# EAGLE design shield (EAGLE 5.10)
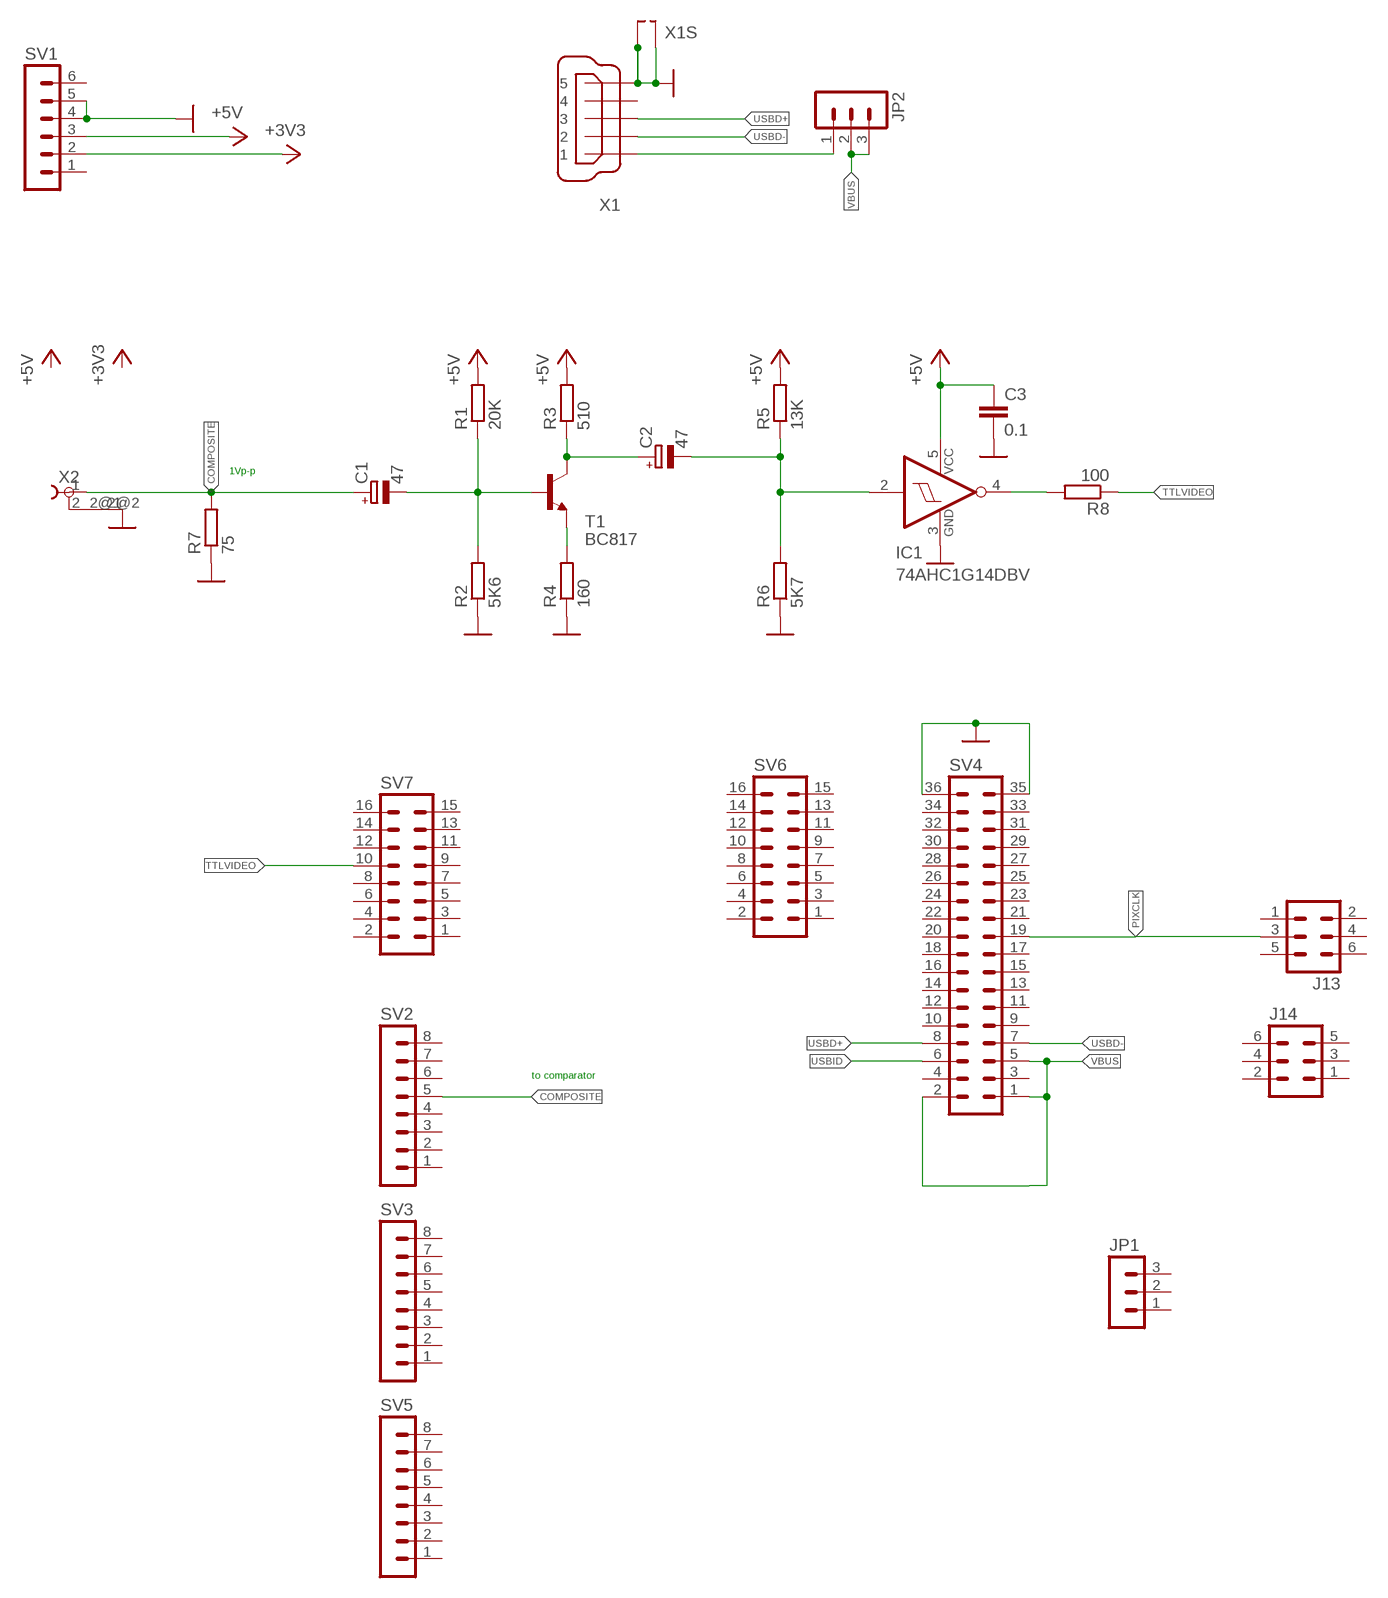
[diagram p0: schematic, sheet 1]

## Parts
C1  47  CPOL-EUSMCC  [SMC_C]
C2  47  CPOL-EUSMCC  [SMC_C]
C3  0.1  C-EUC0603  [C0603]
IC1  74AHC1G14DBV  [SOT23-5]
J13  MA03-2  [MA03-2]
J14  MA03-2  [MA03-2]
JP1  MA03-1  [MA03-1]
JP2  MA03-1  [MA03-1]
R1  20K  R-EU_R0805  [R0805]
R2  5K6  R-EU_R0805  [R0805]
R3  510  R-EU_R0805  [R0805]
R4  160  R-EU_R0805  [R0805]
R5  13K  R-EU_R0805  [R0805]
R6  5K7  R-EU_R0805  [R0805]
R7  75  R-EU_R0805  [R0805]
R8  100  R-EU_R0805  [R0805]
SV1  MA06-1  [MA06-1]
SV2  MA08-1  [MA08-1]
SV3  MA08-1  [MA08-1]
SV4  MA18-2  [MA18-2]
SV5  MA08-1  [MA08-1]
SV6  MA08-2  [MA08-2]
SV7  MA08-2  [MA08-2]
T1  BC817  BC817-16-NPN-SOT23-BEC  [SOT23-BEC]
X1  MINI-USB_SHIELD5P2-32005-601  [32005-601]
X2  TOBU3  [TOBU3]

## Nets
+3V3: SV1.2
+5V: C3.1 IC1.5(VCC) R1.2 R3.2 R5.2 SV1.3
COMPOSITE: C1.+ R7.2 SV2.5 X2.1
GND: C3.2 IC1.3(GND) R2.1 R4.1 R6.1 R7.1 SV1.4 SV1.5 SV4.35 SV4.36 X1.5 X1.M1(S1) X1.M2(S2) X2.2@2
N$1: IC1.4(O) R8.2
N$2: C1.- R1.1 R2.2 T1.B
N$3: R4.2 T1.E
N$4: C2.+ R3.1 T1.C
N$5: C2.- IC1.2(I) R5.1 R6.2
N$6: JP2.1 X1.1
PIXCLK: J13.3 SV4.19
TTLVIDEO: R8.1 SV7.10
USBD+: SV4.8 X1.3
USBD-: SV4.7 X1.2
USBID: SV4.6
VBUS: JP2.2 JP2.3 SV4.1 SV4.2 SV4.5
Unconnected: J13.1 J13.2 J13.4 J13.5 J13.6 J14.1 J14.2 J14.3 J14.4 J14.5 J14.6 JP1.1 JP1.2 JP1.3 SV1.1 SV1.6 SV2.1 SV2.2 SV2.3 SV2.4 SV2.6 SV2.7 SV2.8 SV3.1 SV3.2 SV3.3 SV3.4 SV3.5 SV3.6 SV3.7 SV3.8 SV4.3 SV4.4 SV4.9 SV4.10 SV4.11 SV4.12 SV4.13 SV4.14 SV4.15 SV4.16 SV4.17 SV4.18 SV4.20 SV4.21 SV4.22 SV4.23 SV4.24 SV4.25 SV4.26 SV4.27 SV4.28 SV4.29 SV4.30 SV4.31 SV4.32 SV4.33 SV4.34 SV5.1 SV5.2 SV5.3 SV5.4 SV5.5 SV5.6 SV5.7 SV5.8 SV6.1 SV6.2 SV6.3 SV6.4 SV6.5 SV6.6 SV6.7 SV6.8 SV6.9 SV6.10 SV6.11 SV6.12 SV6.13 SV6.14 SV6.15 SV6.16 SV7.1 SV7.2 SV7.3 SV7.4 SV7.5 SV7.6 SV7.7 SV7.8 SV7.9 SV7.11 SV7.12 SV7.13 SV7.14 SV7.15 SV7.16 X1.4 X2.2 X2.2@1

## Notes on the sheet
- 1Vp-p
- to comparator

## Library data of the parts
C1 C2 = rcl:CPOL-EU: POLARIZED CAPACITOR, European symbol
C3 = rcl:C-EU: CAPACITOR, European symbol
IC1 = 74xx-little-us:74*1G14: Single Schmitt-Trigger Inverter Gate
J13 J14 = con-lstb:MA03-2: PIN HEADER
JP1 JP2 = con-lstb:MA03-1: PIN HEADER
R1-R8 = rcl:R-EU_: RESISTOR, European symbol
SV1 = con-lstb:MA06-1: PIN HEADER
SV2 SV3 SV5 = con-lstb:MA08-1: PIN HEADER
SV4 = con-lstb:MA18-2: PIN HEADER
SV6 SV7 = con-lstb:MA08-2: PIN HEADER
T1 = transistor:*-NPN-: NPN Transistror BF959 corrected 2008.03.06
X1 = usb-mini:MINI-USB_SHIELD5P2-: MINI USB-B R/A DIP 5pol. Source: www.cypressindustries.com
X2 = con-hirschmann:TOBU3: Female Cinch CONNECTOR ( RCA Jack )

## Board
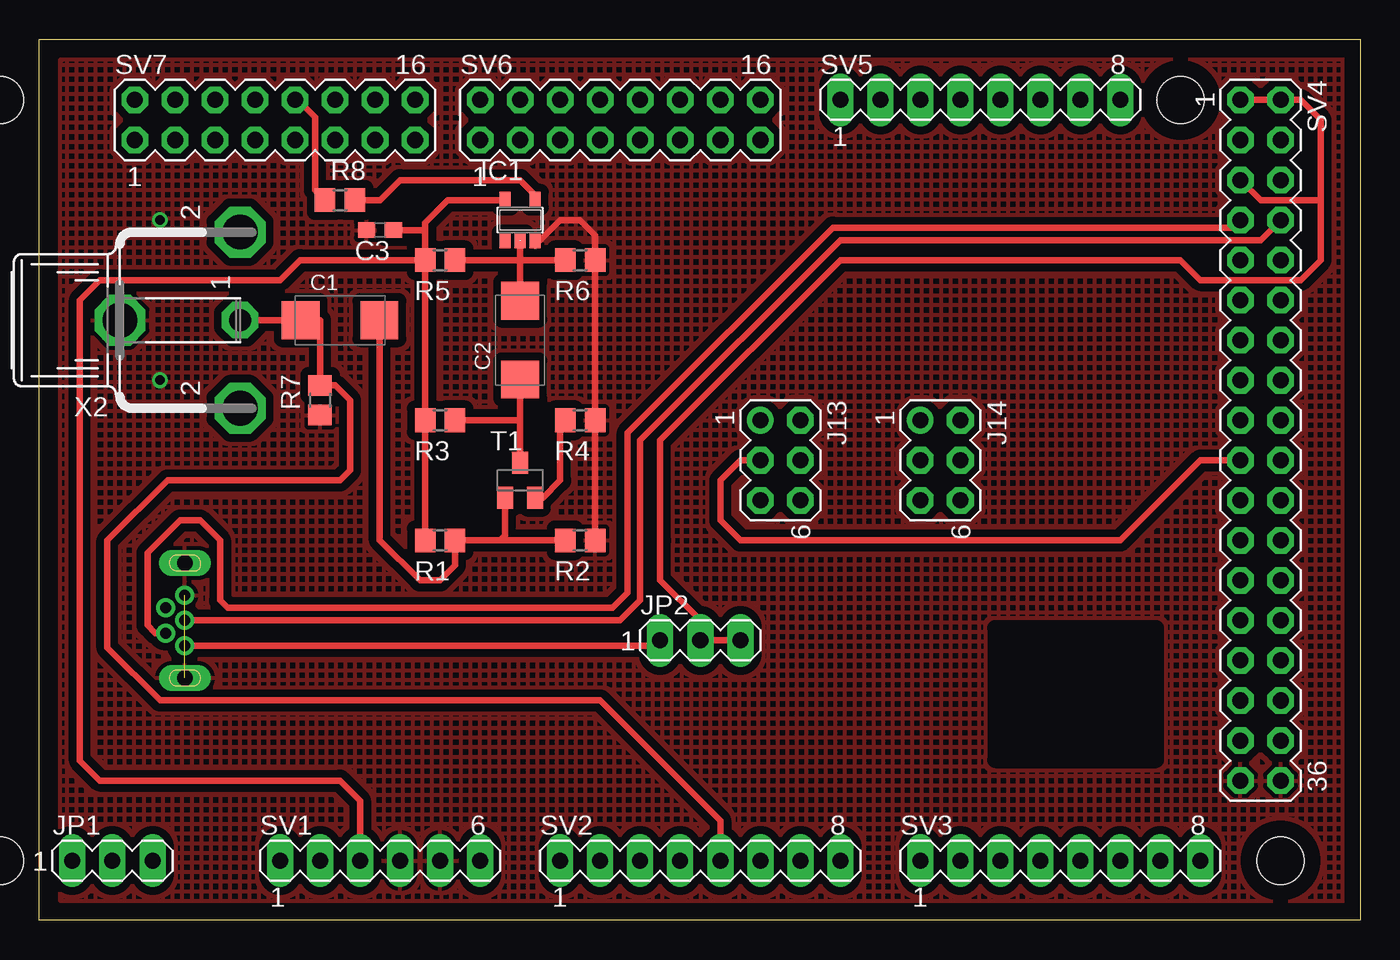
[diagram p1: board, top side]
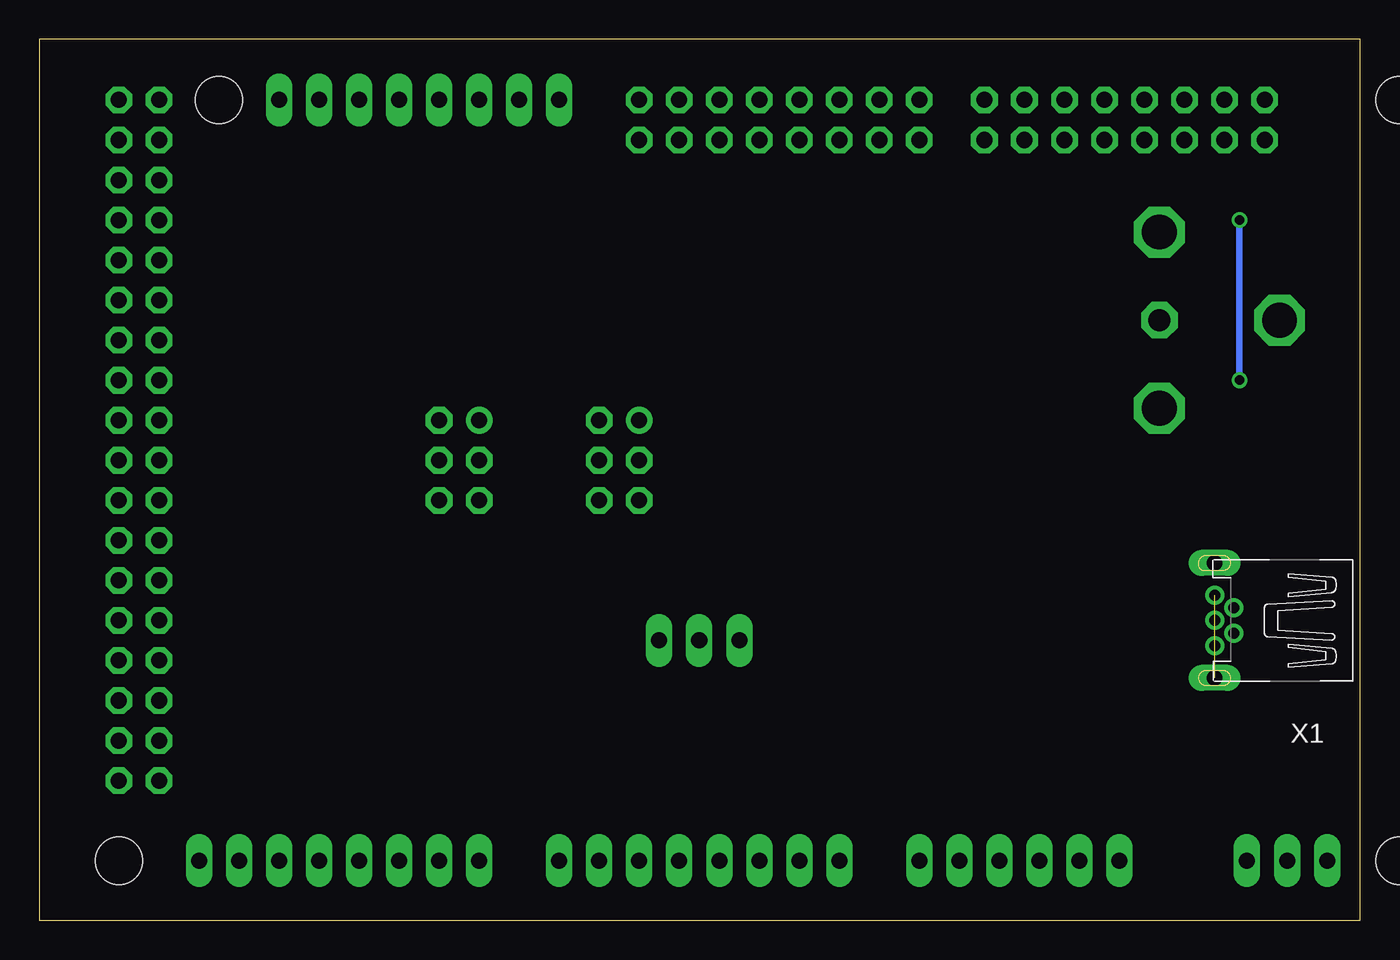
[diagram p2: board, bottom side, seen from below]

Size 83.82 x 55.88 mm. Coordinates in mm from the lower left corner, seen from the top.
Outline: 0,0 0,55.88 83.82,55.88 83.82,0 0,0
Copper layers (1*16): Top 0.035mm / dielectric 1.5mm / Bottom 0.035mm
Design rules "default *": minimum track width 10mil, minimum drill 24mil, track to track 8mil, track to pad 8mil, pad to pad 8mil, via to via 8mil, smd to smd 8mil, copper to edge 40mil, drill to drill 8mil, minimum pad ring 10mil, minimum via ring 8mil, stop-mask expansion 4mil, vias tented up to drill 0mil, thermal gap 10mil
Holes 3 mm at -2.51,3.78 78.77,3.78 72.42,52.04 -2.51,52.04
tRestrict: area 60.7,10.2 to 70.9,18.5

### Footprints (pad centres in the part's own frame; a part is rotated, then mirrored left to right if it is on the bottom)
SMC_C = smd 2.4 x 2.4: + -2.5,0; - 2.5,0
C0603 = smd 1.1 x 1: 1 -0.85,0; 2 0.85,0
SOT23-5 = smd 0.69 x 0.99: 1 -0.95,-1.29; 2 0,-1.29; 3 0.95,-1.29; 4 0.95,1.3; 5 -0.95,1.3
MA03-2 = drill 1.016 round: 1 -2.54,-1.27 | drill 1.016 octagon: 2 -2.54,1.27; 3 0,-1.27; 4 0,1.27; 5 2.54,-1.27; 6 2.54,1.27
MA03-1 = drill 1.016 long: 1 -2.54,0; 2 0,0; 3 2.54,0
R0805 = smd 1.3 x 1.5: 1 -0.95,0; 2 0.95,0
MA06-1 = drill 1.016 long: 1 -6.35,0; 2 -3.81,0; 3 -1.27,0; 4 1.27,0; 5 3.81,0; 6 6.35,0
MA08-1 = drill 1.016 long: 1 -8.89,0; 2 -6.35,0; 3 -3.81,0; 4 -1.27,0; 5 1.27,0; 6 3.81,0; 7 6.35,0; 8 8.89,0
MA18-2 = drill 1.016 octagon: 1 -21.59,-1.27; 2 -21.59,1.27; 3 -19.05,-1.27; 4 -19.05,1.27; 5 -16.51,-1.27; 6 -16.51,1.27; 7 -13.97,-1.27; 8 -13.97,1.27; 9 -11.43,-1.27; 10 -11.43,1.27; 11 -8.89,-1.27; 12 -8.89,1.27; 13 -6.35,-1.27; 14 -6.35,1.27; 15 -3.81,-1.27; 16 -3.81,1.27; 17 -1.27,-1.27; 18 -1.27,1.27; 19 1.27,-1.27; 20 1.27,1.27; 21 3.81,-1.27; 22 3.81,1.27; 23 6.35,-1.27; 24 6.35,1.27; 25 8.89,-1.27; 26 8.89,1.27; 27 11.43,-1.27; 28 11.43,1.27; 29 13.97,-1.27; 30 13.97,1.27; 31 16.51,-1.27; 32 16.51,1.27; 33 19.05,-1.27; 34 19.05,1.27; 35 21.59,-1.27; 36 21.59,1.27
MA08-2 = drill 1.016 octagon: 1 -8.89,-1.27; 2 -8.89,1.27; 3 -6.35,-1.27; 4 -6.35,1.27; 5 -3.81,-1.27; 6 -3.81,1.27; 7 -1.27,-1.27; 8 -1.27,1.27; 9 1.27,-1.27; 10 1.27,1.27; 11 3.81,-1.27; 12 3.81,1.27; 13 6.35,-1.27; 14 6.35,1.27; 15 8.89,-1.27; 16 8.89,1.27
SOT23-BEC = smd 1 x 1.4: B -0.95,-1.1; C 0,1.1; E 0.95,-1.1
32005-601 = drill 0.7 pad 1.016 round: 1 2.825,1.6; 2 1.625,0.8; 3 2.825,0; 4 1.625,-0.8; 5 2.825,-1.6 | drill 1 pad 1.422 long: M1 2.855,3.65; M2 2.855,-3.65
TOBU3 = drill 1.397 octagon: 1 0,-2.54 | drill 2.21 octagon: 2 5.588,-2.54; 2@1 -5.588,-2.54; 2@2 0,5.08

### Placement (x,y rotation side)
C1  19.08,38.07 0 top
C2  30.51,36.8 90 top
C3  21.62,43.78 180 top
IC1  30.51,44.42 0 top
J13  47.02,29.18 270 top
J14  57.18,29.18 270 top
JP1  4.64,3.78 0 top
JP2  41.94,17.75 0 top
R1  25.43,24.1 180 top
R2  34.32,24.1 180 top
R3  25.43,31.72 180 top
R4  34.32,31.72 180 top
R5  25.43,41.88 180 top
R6  34.32,41.88 180 top
R7  17.81,32.99 90 top
R8  19.08,45.69 0 top
SV1  21.62,3.78 0 top
SV2  41.94,3.78 0 top
SV3  64.8,3.78 0 top
SV4  77.5,30.45 270 top
SV5  59.72,52.04 0 top
SV6  36.86,50.77 0 top
SV7  14.95,50.77 0 top
T1  30.51,27.91 0 top
X1  6.38,19.02 180 bottom
X2  10.19,38.07 90 top

### Tracks (layer width: path | path; a pad name or v marks a point on that pad's centre or on a via)
+5V
  Top 0.406: R1.2 R3.2 R5.2 | R5.2 24.48,43.47 24.48,43.62 | IC1.5 29.53,45.69 26.7,45.69 25.91,45.69 24.48,44.26 24.48,43.62 | SV1.3 20.35,7.59 19.08,8.86 3.84,8.86 2.57,10.13 2.57,39.34 3.84,40.61 15.27,40.61 16.54,41.88 R5.2 | C3.1 24.32,43.78 24.48,43.62
COMPOSITE
  Top 0.406: X2.1 16.54,38.07 C1.+ 17.81,38.07 R7.2 18.77,33.94 19.72,32.99 19.72,28.54 19.08,27.91 8.13,27.91 4.32,24.1 4.32,17.27 7.65,13.94 35.59,13.94 43.21,6.32 SV2.5
GND  (via drill 0.6)  (1 unrouted)
  Top 0.406: R2.1 R4.1 R6.1 35.27,43.47 34.32,44.42 33.05,44.42 31.78,43.15 31.48,43.15 IC1.3
  Bottom 0.406: v7.65,34.26 v7.65,44.42
  pour Top (isolate 0.5, hatched): 1.3,53.31 1.3,1.24 83.85,1.24 83.85,54.58 1.3,54.58
N$1
  Top 0.406: IC1.4 31.46,46.01 30.51,46.96 22.89,46.96 21.62,45.69 R8.2
N$2
  Top 0.406: C1.- 21.61,24.11 24.16,21.56 25.43,21.56 26.38,22.51 R1.1 29.24,24.1 | 29.24,24.1 R2.2 | T1.B 29.56,24.42 29.24,24.1
N$3
  Top 0.406: T1.E 31.95,26.81 33.05,27.91 33.05,31.4 R4.2
N$4
  Top 0.406: T1.C 30.51,31.72 | 30.51,31.72 30.51,34.26 C2.+ | 30.51,31.72 R3.1
N$5
  Top 0.406: R5.1 30.51,41.88 | 30.51,41.88 R6.2 | 30.51,41.88 IC1.2 | 30.51,41.88 C2.-
N$6
  Top 0.406: X1.1 39.07,17.42 JP2.1
PIXCLK
  Top 0.406: J13.3 44.48,29.18 43.21,27.91 43.21,25.37 44.48,24.1 68.61,24.1 73.69,29.18 SV4.19
TTLVIDEO
  Top 0.406: SV7.10 16.38,52.04 17.34,51.09 17.49,50.93 17.49,46.33 R8.1
USBD+
  Top 0.406: SV4.8 77.5,43.15 50.83,43.15 38.13,30.45 38.13,20.29 36.86,19.02 X1.3
USBD-
  Top 0.406: SV4.7 75.76,43.94 50.36,43.94 50.2,43.78 37.34,30.92 37.34,20.76 36.39,19.81 11.94,19.81 11.46,20.29 11.46,24.1 10.19,25.37 8.92,25.37 8.01,24.45 6.86,23.3 6.86,20.97 6.86,18.7 7.34,18.22 X1.2
VBUS
  Top 0.406: SV4.5 77.5,45.69 80.04,45.69 81.31,45.69 | JP2.3 JP2.2 41.94,19.02 39.4,21.56 39.4,24.1 39.4,30.45 50.83,41.88 72.42,41.88 73.69,40.61 80.04,40.61 81.31,41.88 81.31,44.42 81.31,45.69 | SV4.2 SV4.1 80.04,52.04 81.31,50.77 81.31,45.69

### Text on the board
201bmp: SVO 2011